# EAGLE design sensormodules (EAGLE 8.1.1)

## Sheet 1 of 2
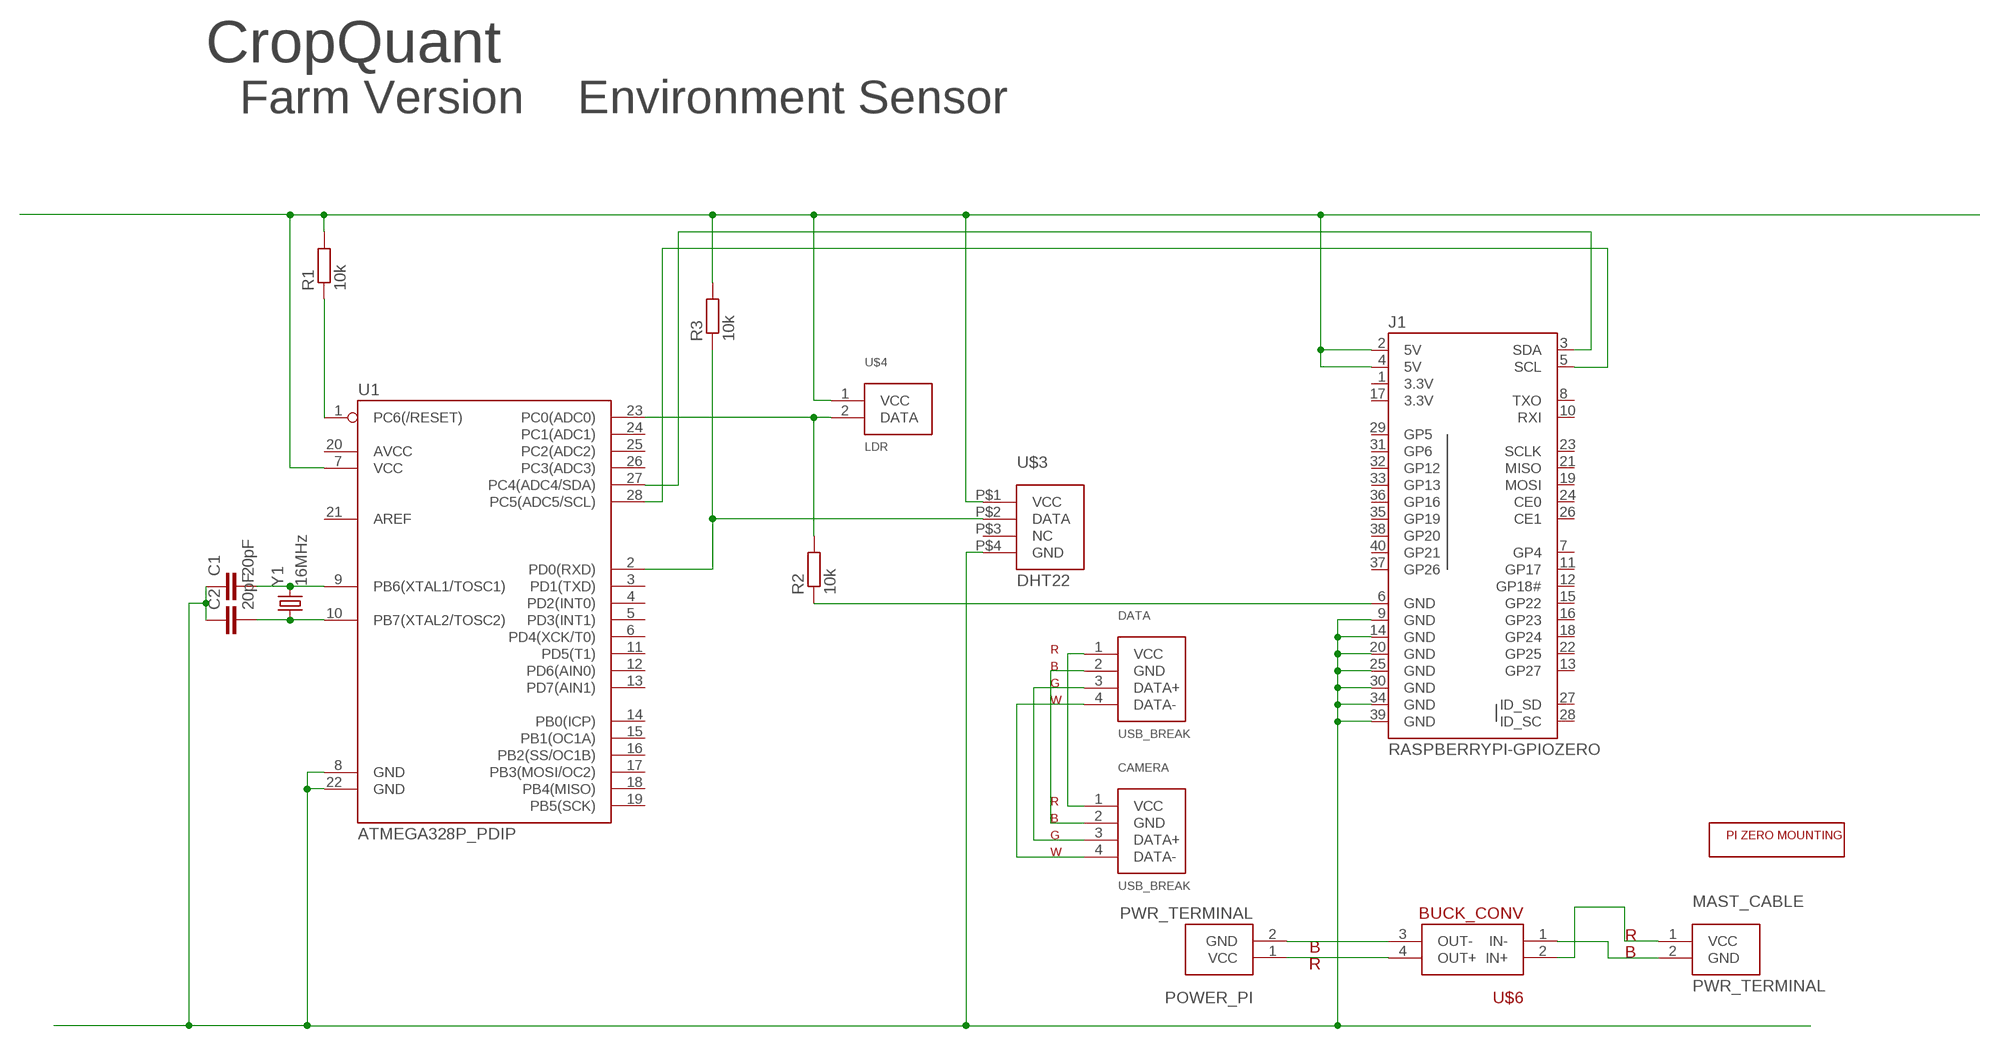
[diagram p0: schematic, sheet 1]

### Parts
C1  20pF  CAPPTH  [CAP-PTH-SMALL]
C2  20pF  CAPPTH  [CAP-PTH-SMALL]
CAMERA  USB_BREAK  [USB_BREAK]
DATA  USB_BREAK  [USB_BREAK]
J1  RASPBERRYPI-GPIOZERO  [2X20-ZERO]
MAST_CABLE  PWR_TERMINAL  [PWR_TERMINAL]
POWER_PI  PWR_TERMINAL  [PWR_TERMINAL]
R1  10k  R-EU_0204/7  [0204/7]
R2  10k  R-EU_0204/7  [0204/7]
R3  10k  R-EU_0204/7  [0204/7]
U1  ATMEGA328P_PDIP  [DIL28-3]
U$3  DHT22  [DHT22]
U$4  LDR  [LDR]
U$5  PI_ZERO_MOUNT  [ZERO_MOUNT]
U$6  BUCK_CONV  [BUCK_CONV]
Y1  16MHz  CRYSTALHC49US  [HC49US]

### Nets
N$2: J1.2(5V) J1.4(5V) R1.2 R3.2 U1.7(VCC) U$3.P$1(VCC) U$4.1(VCC)
N$3: R1.1 U1.1(PC6(/RESET))
N$4: J1.3(SDA) U1.27(PC4(ADC4/SDA))
N$5: J1.5(SCL) U1.28(PC5(ADC5/SCL))
N$9: R3.1 U1.2(PD0(RXD)) U$3.P$2(DATA)
N$10: R2.2 U1.23(PC0(ADC0)) U$4.2(DATA)
N$11: CAMERA.1(VCC) DATA.1(VCC)
N$12: C2.2 U1.10(PB7(XTAL2/TOSC2)) Y1.1
N$14: CAMERA.2(GND) DATA.2(GND)
N$15: CAMERA.3(DATA+) DATA.3(DATA+)
N$17: CAMERA.4(DATA-) DATA.4(DATA-)
N$18: POWER_PI.2(GND) U$6.3(OUT-)
N$19: MAST_CABLE.2(GND) U$6.1(IN-)
N$20: C1.2 U1.9(PB6(XTAL1/TOSC1)) Y1.2
N$21: J1.6(GND) R2.1
N$24: MAST_CABLE.1(VCC) U$6.2(IN+)
N$26: POWER_PI.1(VCC) U$6.4(OUT+)
N$27: C1.1 C2.1 J1.9(GND) J1.14(GND) J1.20(GND) J1.25(GND) J1.30(GND) J1.34(GND) J1.39(GND) U1.8(GND) U1.22(GND) U$3.P$4(GND)
Unconnected: J1.7(GP4) J1.8(TXO) J1.10(RXI) J1.11(GP17) J1.12(GP18#) J1.13(GP27) J1.15(GP22) J1.16(GP23) J1.18(GP24) J1.19(MOSI) J1.21(MISO) J1.22(GP25) J1.23(SCLK) J1.24(CE0) J1.26(CE1) J1.27(ID_SD) J1.28(ID_SC) J1.29(GP5) J1.31(GP6) J1.32(GP12) J1.33(GP13) J1.35(GP19) J1.36(GP16) J1.37(GP26) J1.38(GP20) J1.40(GP21) U1.3(PD1(TXD)) U1.4(PD2(INT0)) U1.5(PD3(INT1)) U1.6(PD4(XCK/T0)) U1.11(PD5(T1)) U1.12(PD6(AIN0)) U1.13(PD7(AIN1)) U1.14(PB0(ICP)) U1.15(PB1(OC1A)) U1.16(PB2(SS/OC1B)) U1.17(PB3(MOSI/OC2)) U1.18(PB4(MISO)) U1.19(PB5(SCK)) U1.20(AVCC) U1.21(AREF) U1.24(PC1(ADC1)) U1.25(PC2(ADC2)) U1.26(PC3(ADC3)) U$3.P$3(NC)

### Notes on the sheet
- CropQuant
- Farm Version | Environment Sensor

## Sheet 2 of 2
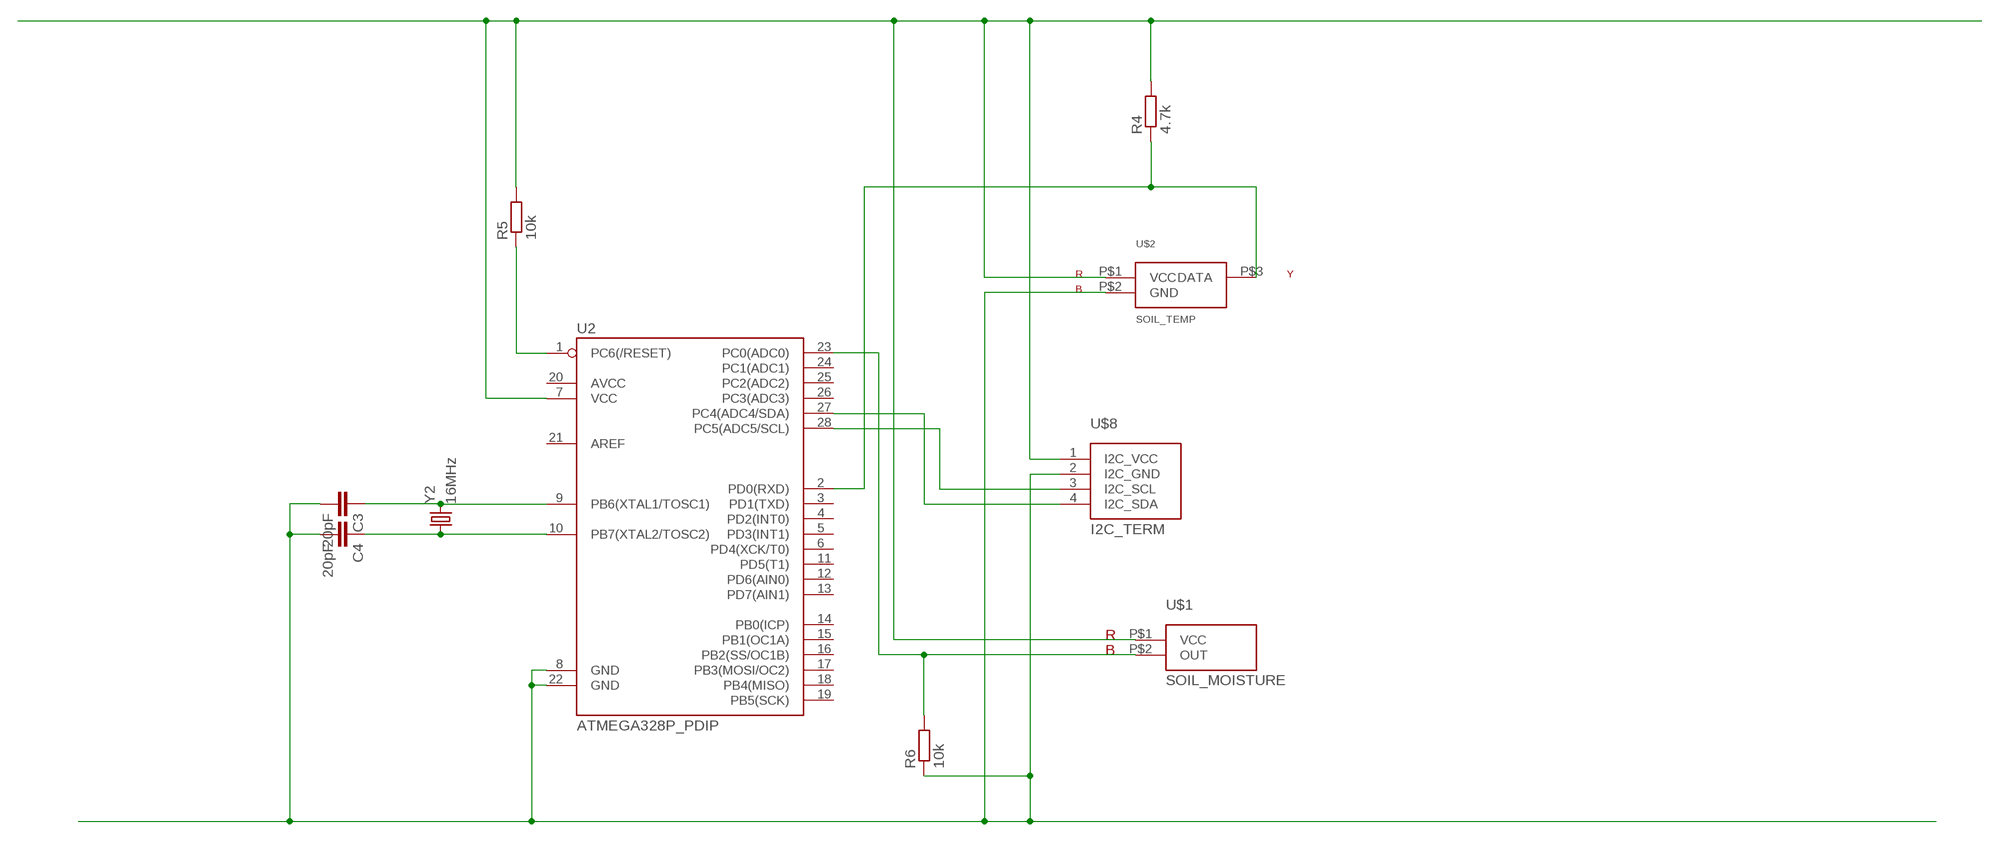
[diagram p1: schematic, sheet 2]

### Parts
C3  20pF  CAPPTH  [CAP-PTH-SMALL]
C4  20pF  CAPPTH  [CAP-PTH-SMALL]
R4  4.7k  R-EU_0204/7  [0204/7]
R5  10k  R-EU_0204/7  [0204/7]
R6  10k  R-EU_0204/7  [0204/7]
U2  ATMEGA328P_PDIP  [DIL28-3]
U$1  SOIL_MOISTURE  [SOIL_MOISTURE]
U$2  SOIL_TEMP  [SOIL_TEMP]
U$8  I2C_TERM  [I2C_TERM]
Y2  16MHz  CRYSTALHC49US  [HC49US]

### Nets
N$1: R4.2 R5.2 U2.7(VCC) U$1.P$1(VCC) U$2.P$1(VCC) U$8.1(I2C_VCC)
N$6: R4.1 U2.2(PD0(RXD)) U$2.P$3(DATA)
N$7: R6.2 U2.23(PC0(ADC0)) U$1.P$2(OUT)
N$8: C3.2 C4.2 R6.1 U2.8(GND) U2.22(GND) U$2.P$2(GND) U$8.2(I2C_GND)
N$13: C4.1 U2.10(PB7(XTAL2/TOSC2)) Y2.1
N$16: C3.1 U2.9(PB6(XTAL1/TOSC1)) Y2.2
N$22: R5.1 U2.1(PC6(/RESET))
N$23: U2.28(PC5(ADC5/SCL)) U$8.3(I2C_SCL)
N$25: U2.27(PC4(ADC4/SDA)) U$8.4(I2C_SDA)
Unconnected: U2.3(PD1(TXD)) U2.4(PD2(INT0)) U2.5(PD3(INT1)) U2.6(PD4(XCK/T0)) U2.11(PD5(T1)) U2.12(PD6(AIN0)) U2.13(PD7(AIN1)) U2.14(PB0(ICP)) U2.15(PB1(OC1A)) U2.16(PB2(SS/OC1B)) U2.17(PB3(MOSI/OC2)) U2.18(PB4(MISO)) U2.19(PB5(SCK)) U2.20(AVCC) U2.21(AREF) U2.24(PC1(ADC1)) U2.25(PC2(ADC2)) U2.26(PC3(ADC3))

## Power pins joined to a net without a drawn wire
3.3V: J1.1(3.3V) J1.17(3.3V)

## Library data of the parts
C1-C4 = SparkFun-Capacitors:CAP: Capacitor Standard 0603 ceramic capacitor, and 0.1" leaded capacitor.
CAMERA DATA = CropQuant:USB_BREAK
J1 = CropQuant:RASPBERRYPI-GPIO: Second Generation Raspberry Pi GPIO Header 2x20 pin connector, as found on B, B+, A+ models.
MAST_CABLE POWER_PI = CropQuant:PWR_TERMINAL
R1-R6 = resistor:R-EU_: RESISTOR, European symbol
U1 U2 = SparkFun-DigitalIC:ATMEGA328P_PDIP: uC used in the Arduino 32kb flash, 1k EEPROM, 2k SRAM This is the through-hole version of this chip.
U$1 = CropQuant:SOIL_MOISTURE
U$2 = CropQuant:SOIL_TEMP
U$3 = CropQuant:DHT22
U$4 = CropQuant:LDR
U$5 = CropQuant:PI_ZERO_MOUNT
U$6 = CropQuant:BUCK_CONV
U$8 = CropQuant:I2C_TERM
Y1 Y2 = SparkFun-FreqCtrl:CRYSTAL: Various standard crystals. Proven footprints.

## Board
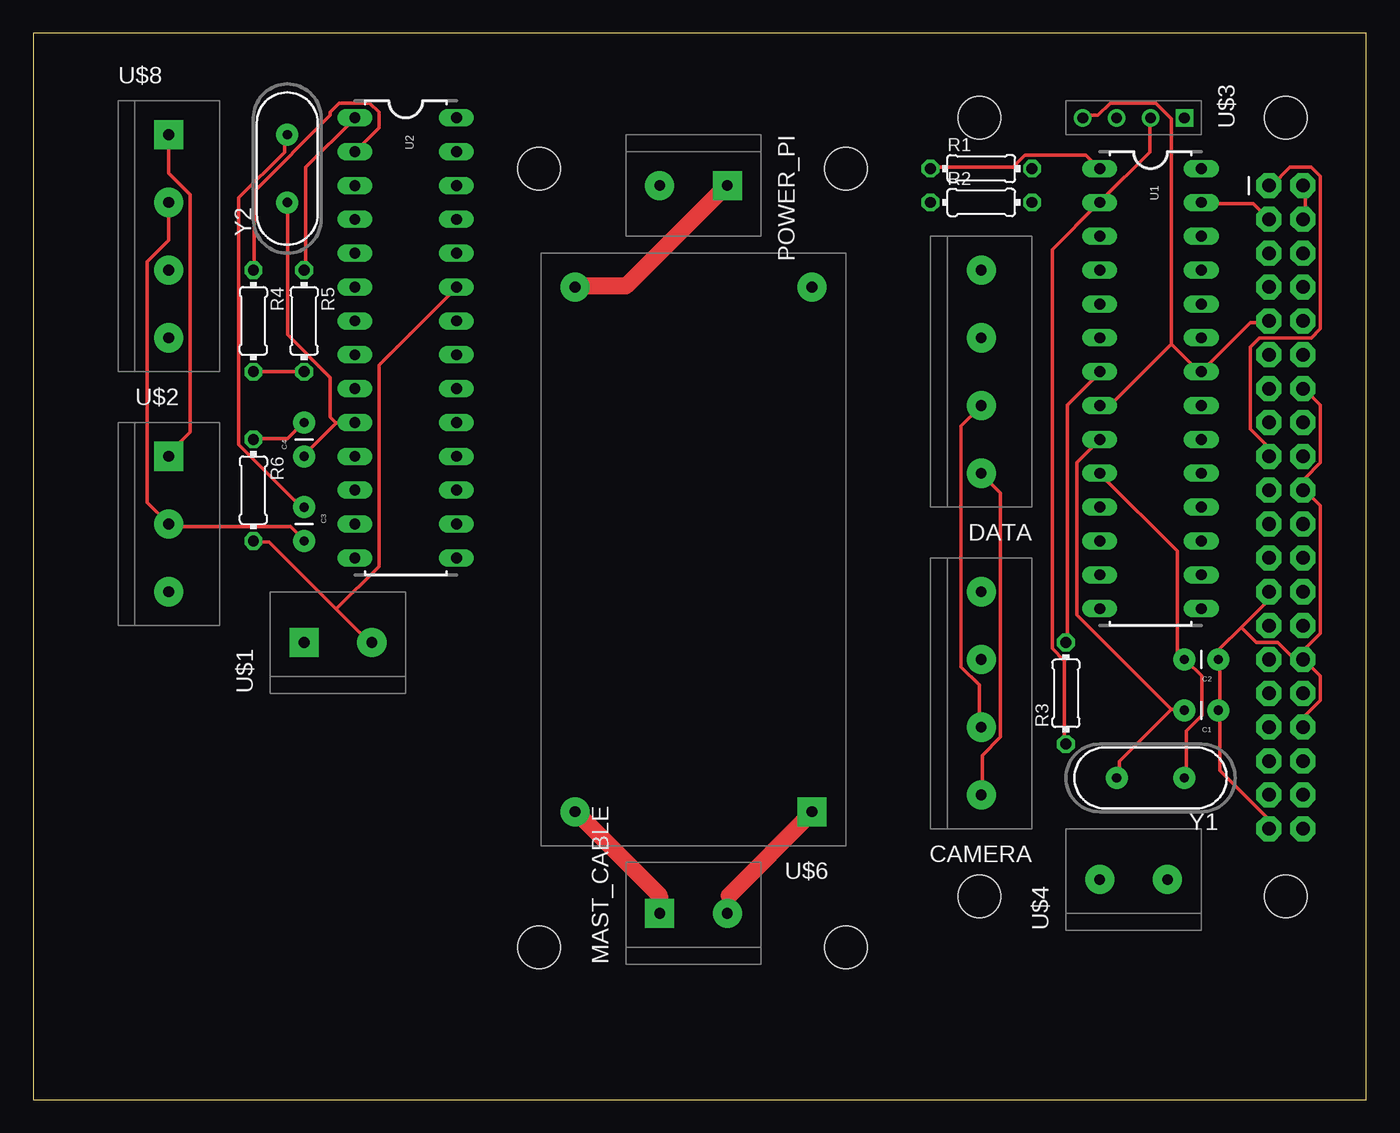
[diagram p2: board, top side]
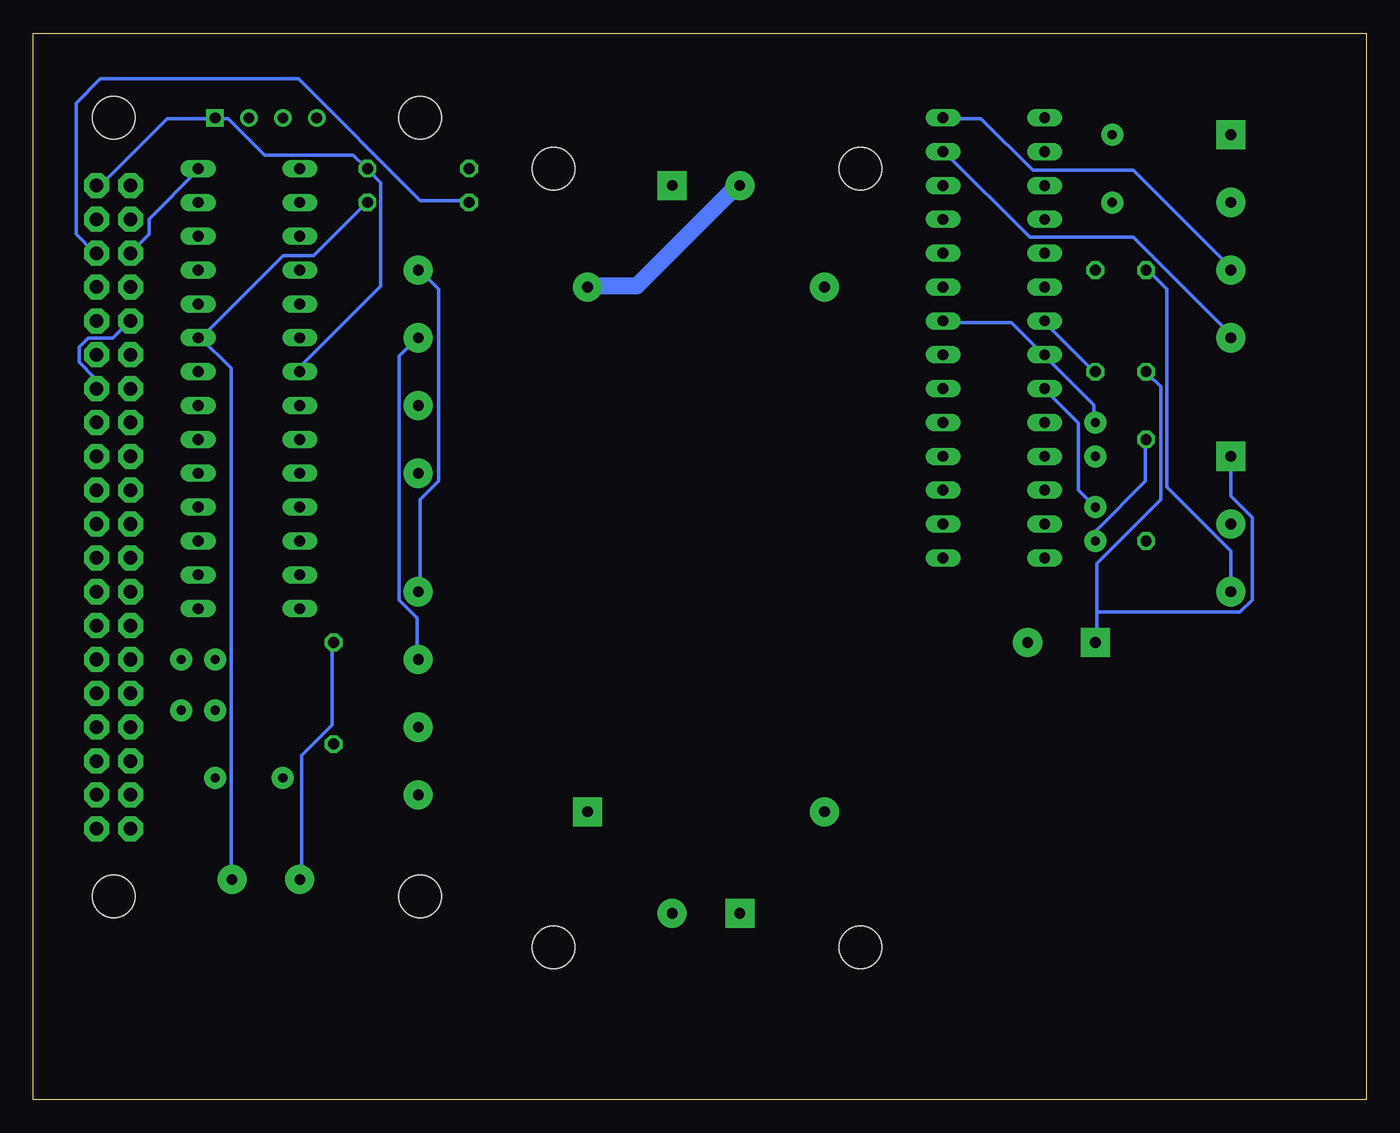
[diagram p3: board, bottom side, seen from below]

Size 100 x 80 mm. Coordinates in mm from the lower left corner, seen from the top.
Outline: 0,0 100,0 100,80 0,80 0,0
Copper layers (1*16): Top 0.035mm / dielectric 1.5mm / Bottom 0.035mm
Design rules "default *": minimum track width 10mil, minimum drill 24mil, track to track 0.15mm, track to pad 0.15mm, pad to pad 0.15mm, via to via 0.15mm, smd to smd 0.15mm, copper to edge 40mil, drill to drill 8mil, minimum pad ring 10mil, minimum via ring 8mil, stop-mask expansion 4mil, vias tented up to drill 0mil, thermal gap 10mil

### Footprints (pad centres in the part's own frame; a part is rotated, then mirrored left to right if it is on the bottom)
CAP-PTH-SMALL = drill 0.7 pad 1.651: 1 0,0; 2 2.54,0
USB_BREAK = drill 0.8 pad 2.184: 1 0,7.62; 2 0,2.54; 3 0,-2.54; 4 0,-7.62
2X20-ZERO = drill 1.016 pad 1.88 octagon: 1 -1.27,24.13; 2 1.27,24.13; 3 -1.27,21.59; 4 1.27,21.59; 5 -1.27,19.05; 6 1.27,19.05; 7 -1.27,16.51; 8 1.27,16.51; 9 -1.27,13.97; 10 1.27,13.97; 11 -1.27,11.43; 12 1.27,11.43; 13 -1.27,8.89; 14 1.27,8.89; 15 -1.27,6.35; 16 1.27,6.35; 17 -1.27,3.81; 18 1.27,3.81; 19 -1.27,1.27; 20 1.27,1.27; 21 -1.27,-1.27; 22 1.27,-1.27; 23 -1.27,-3.81; 24 1.27,-3.81; 25 -1.27,-6.35; 26 1.27,-6.35; 27 -1.27,-8.89; 28 1.27,-8.89; 29 -1.27,-11.43; 30 1.27,-11.43; 31 -1.27,-13.97; 32 1.27,-13.97; 33 -1.27,-16.51; 34 1.27,-16.51; 35 -1.27,-19.05; 36 1.27,-19.05; 37 -1.27,-21.59; 38 1.27,-21.59; 39 -1.27,-24.13; 40 1.27,-24.13 | hole 3.2: 0,29.21; 0,-29.21; -23,29.21; -23,-29.21
PWR_TERMINAL = drill 0.8 pad 2.184 square: 1 0,2.54 | drill 0.8 pad 2.184: 2 0,-2.54
0204/7 = drill 0.813 octagon: 1 -3.81,0; 2 3.81,0
DIL28-3 = drill 0.813 long: 1 -16.51,-3.81; 2 -13.97,-3.81; 3 -11.43,-3.81; 4 -8.89,-3.81; 5 -6.35,-3.81; 6 -3.81,-3.81; 7 -1.27,-3.81; 8 1.27,-3.81; 9 3.81,-3.81; 10 6.35,-3.81; 11 8.89,-3.81; 12 11.43,-3.81; 13 13.97,-3.81; 14 16.51,-3.81; 15 16.51,3.81; 16 13.97,3.81; 17 11.43,3.81; 18 8.89,3.81; 19 6.35,3.81; 20 3.81,3.81; 21 1.27,3.81; 22 -1.27,3.81; 23 -3.81,3.81; 24 -6.35,3.81; 25 -8.89,3.81; 26 -11.43,3.81; 27 -13.97,3.81; 28 -16.51,3.81
SOIL_MOISTURE = drill 0.8 pad 2.184 square: P$1 0,2.54 | drill 0.8 pad 2.184: P$2 0,-2.54
SOIL_TEMP = drill 0.8 pad 2.184 square: P$1 0,5.08 | drill 0.8 pad 2.184: P$2 0,0; P$3 0,-5.08
DHT22 = drill 0.8 square: P$1 0,3.81 | drill 0.8: P$2 0,1.27; P$3 0,-1.27; P$4 0,-3.81
LDR = drill 0.8 pad 2.184: 1 0,2.54; 2 0,-2.54
ZERO_MOUNT = hole 3.2: 0,29.21; 0,-29.21; -23,29.21; -23,-29.21
BUCK_CONV = drill 0.8 pad 2.184 square: 1 -8.89,16.51 | drill 0.8 pad 2.184: 2 8.89,16.51; 3 -8.89,-22.86; 4 8.89,-22.86
I2C_TERM = drill 0.8 pad 2.184 square: 1 0,7.62 | drill 0.8 pad 2.184: 2 0,2.54; 3 0,-2.54; 4 0,-7.62
HC49US = drill 0.7 pad 1.651: 1 -2.54,0; 2 2.54,0

### Placement (x,y rotation side)
C1  88.9,29.21 180 top
C2  88.9,33.02 180 top
C3  20.32,44.45 270 top
C4  20.32,48.26 90 top
CAMERA  71.12,30.48 180 top
DATA  71.12,54.61 180 top
J1  93.98,44.45 0 top
MAST_CABLE  49.53,13.97 90 top
POWER_PI  49.53,68.58 270 top
R1  71.12,69.85 0 top
R2  71.12,67.31 0 top
R3  77.47,30.48 90 top
R4  16.51,58.42 270 top
R5  20.32,58.42 270 top
R6  16.51,45.72 270 top
U1  83.82,53.34 270 top
U2  27.94,57.15 270 top
U$1  22.86,34.29 90 top
U$2  10.16,43.18 0 top
U$3  82.55,73.66 270 top
U$4  82.55,16.51 90 top
U$5  60.96,40.64 0 top
U$6  49.53,38.1 180 top
U$8  10.16,64.77 0 top
Y1  83.82,24.13 180 top
Y2  19.05,69.85 90 top

### Tracks (layer width: path | path; a pad name or v marks a point on that pad's centre or on a via)
3.3V
  Top 0.254: J1.17 92.69,48.46 92.69,48.92 91.31,50.29 91.31,56.46 92,57.15 95.89,57.15 96.57,57.84 96.57,69.27 95.89,69.95 94.29,69.95 92.91,68.58 J1.1
N$1
  Top 0.254: R4.2 16.56,54.63 20.22,54.63 R5.2 | U$8.1 10.16,69.49 11.76,67.89 11.76,50.06 10.16,48.46 U$2.P$1
  Bottom 0.254: U2.7 24.11,58.29 20.45,54.63 R5.2 | 20.22,36.58 20.22,40.23 15.42,45.03 15.42,53.49 16.33,54.41 R4.2 | 20.22,36.58 20.22,34.29 U$1.P$1 | U$2.P$1 10.16,45.26 8.56,43.66 8.56,37.49 9.47,36.58 20.22,36.58
N$2
  Top 0.254: J1.4 95.43,66.06 95.43,68.58 J1.2 | R3.2 77.6,34.29 77.6,52.12 79.88,54.41 U1.7
  Bottom 0.254: R3.2 77.6,34.29 77.6,28.12 79.88,25.83 79.88,16.69 U$4.1 | J1.2 94.97,68.58 89.94,73.61 86.51,73.61 U$3.P$1 86.28,73.61 85.37,73.61 82.63,70.87 76,70.87 75.08,69.95 R1.2 74.85,69.72 73.94,68.81 73.94,61.04 79.88,55.09 79.88,54.63 U1.7
N$3
  Top 0.254: R1.1 67.31,69.95 73.48,69.95 74.4,70.87 78.97,70.87 79.88,69.95 U1.1
N$4
  Top 0.254: J1.3 91.54,67.21 87.66,67.21 U1.27
N$5
  Bottom 0.254: U1.28 87.66,69.72 91.31,66.06 91.31,64.92 92.69,63.55 J1.5
N$6
  Top 0.254: U2.2 25.93,72.92 25.93,74.07 25.25,74.75 22.96,74.75 22.28,74.07 22.28,73.84 16.56,68.12 16.56,62.41 R4.1
  Bottom 0.254: U$2.P$3 10.16,41.15 14.96,45.95 14.96,60.81 16.33,62.18 R4.1
N$7
  Top 0.254: 22.73,36.8 25.25,34.29 U$1.P$2 | 22.73,36.8 17.7,41.83 16.56,41.83 R6.2 | 22.73,36.8 25.93,40.01 25.93,55.09 31.65,60.81 U2.23
N$8
  Top 0.254: 20.45,50.98 C4.2 20.22,50.75 19.07,49.61 16.56,49.61 R6.1 | C3.2 20.22,42.06 19.3,42.98 10.16,42.98 U$2.P$2 10.16,43.2 8.56,44.81 8.56,62.87 10.16,64.47 U$8.2
  Bottom 0.254: C4.2 20.45,50.98 20.45,52.12 24.11,55.78 U2.8 24.33,56.01 26.62,58.29 31.65,58.29 U2.22 | C3.2 20.22,42.06 20.22,42.75 16.56,46.41 16.56,49.38 R6.1
N$9
  Top 0.254: U$3.P$2 83.77,73.61 83.77,71.09 80.11,67.44 U1.2 79.88,67.21 76.45,63.78 76.45,33.83 77.37,32.92 77.37,26.75 R3.1
N$10
  Bottom 0.254: 87.43,57.15 81.26,63.32 78.97,63.32 75.08,67.21 R2.2 | 87.43,57.15 85.14,54.86 85.14,16.69 U$4.2 | 87.43,57.15 U1.23
N$11
  Top 0.254: CAMERA.1 71.2,22.86 71.2,25.83 72.57,27.2 72.57,45.49 71.2,46.86 DATA.1
N$12
  Top 0.254: U1.10 80.11,46.86 85.83,41.15 85.83,33.6 86.28,33.15 C2.2 86.51,32.92 87.66,31.77 87.66,28.8 86.51,27.66 86.51,24.23 Y1.1
N$13
  Top 0.254: 22.73,50.75 24.11,50.75 U2.10 | 22.73,50.75 20.45,48.46 C4.1 | 22.73,50.75 22.28,51.21 22.28,54.18 19.07,57.38 19.07,67.21 Y2.1
N$14
  Top 0.254: CAMERA.2 70.97,28.12 70.97,31.09 69.6,32.46 69.6,50.52 70.97,51.89 DATA.2
N$15
  Bottom 0.254: CAMERA.3 71.2,33.15 71.2,36.12 72.57,37.49 72.57,55.78 71.2,57.15 DATA.3
N$16
  Top 0.254: Y2.2 18.85,72.24 18.85,71.09 15.42,67.67 15.42,49.15 20.22,44.35 C3.1
  Bottom 0.254: C3.1 21.59,45.72 21.59,50.75 24.11,53.26 U2.9
N$17
  Bottom 0.254: CAMERA.4 70.97,38.18 70.97,45.03 69.6,46.41 69.6,60.81 70.97,62.18 DATA.4
N$18
  Bottom 0.254: 58.39,61.04 U$6.3 | 47.19,68.58 POWER_PI.2
  Bottom 1.27: 58.39,61.04 54.74,61.04 47.19,68.58
N$19
  Top 0.254: 52.22,15.32 52.22,14.17 | 58.39,21.49 U$6.1
  Top 1.27: 58.39,21.49 52.22,15.32 | 52.22,14.17 MAST_CABLE.2
N$20
  Top 0.254: 85.37,29.26 78.28,36.35 78.28,47.78 79.88,49.38 U1.9 | 85.37,29.26 86.28,29.26 C1.2 | 85.37,29.26 81.48,25.38 81.48,24.23 Y1.2
N$21
  Bottom 0.254: R2.1 67.31,67.44 70.97,67.44 80.11,76.58 94.97,76.58 96.8,74.75 96.8,64.92 95.43,63.55 J1.6
N$22
  Top 0.254: R5.1 20.45,62.41 20.45,69.95 24.11,73.61 U2.1
N$23
  Bottom 0.254: U2.28 31.65,73.61 28.91,73.61 25.02,69.72 17.48,69.72 10.16,62.41 U$8.3
N$24
  Top 0.254: 46.96,14.17 MAST_CABLE.1 | 40.79,21.49 U$6.2
  Top 1.27: 46.96,14.17 46.96,15.32 40.79,21.49
N$25
  Bottom 0.254: U$8.4 10.16,57.38 17.48,64.69 25.25,64.69 31.65,71.09 U2.27
N$26
  Top 0.254: 40.79,61.04 U$6.4 | 51.99,68.58 POWER_PI.1
  Top 1.27: 40.79,61.04 44.45,61.04 51.99,68.58
N$27
  Top 0.254: J1.34 95.43,28.12 95.43,28.8 96.57,29.95 96.57,31.77 95.43,32.92 J1.30 | J1.39 92.69,20.34 92.69,21.03 89.03,24.69 89.03,29.03 C1.1 89.03,29.26 89.03,32.92 C2.1 89.03,33.15 89.03,33.83 90.63,35.43 | 90.63,35.43 92.69,37.49 92.69,37.95 J1.25 | 90.63,35.43 91.77,34.29 93.37,34.29 94.51,33.15 95.2,33.15 J1.30 | 95.43,45.72 95.43,46.63 96.57,47.78 96.57,52.12 95.43,53.26 J1.14 | 85.37,56.69 85.37,73.61 84.23,74.75 80.8,74.75 79.88,73.84 78.74,73.84 U$3.P$4 | 85.37,56.69 87.43,54.63 U1.22 91.31,58.29 92.69,58.29 J1.9 | 85.37,56.69 80.8,52.12 80.11,52.12 U1.8 | 95.43,45.72 96.57,44.58 96.57,34.98 95.43,33.83 95.43,33.15 J1.30 | 95.43,45.72 J1.20
  Bottom 0.254: J1.14 95.43,53.49 95.43,54.18 96.57,55.32 96.57,56.46 95.89,57.15 94.06,57.15 92.91,58.29 J1.9

### Text on the board
tDocu: PI_PWR | DHT22 | 10k | 10k | ATMEGA 328P | PI_I2C | ATMEGA 328P | 47k | 10k | DATA | BUCK | 10k | CONV | SOIL_TEMP | 10k | SOIL_MOISTURE | CAMERA | LDR | ZM_CABLE